# EAGLE design Hotec_H-bridge (EAGLE 7.6.0)
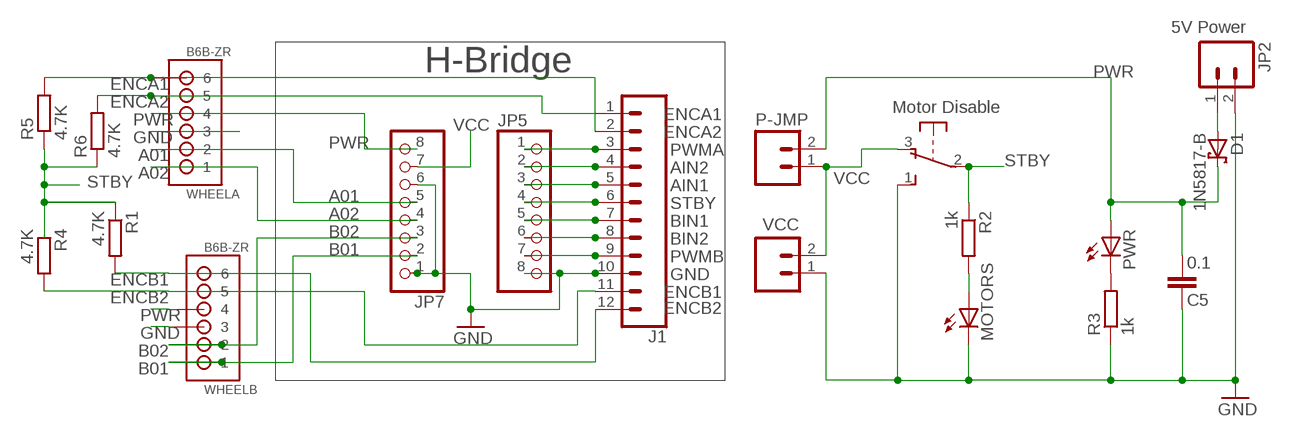
[diagram p0: schematic, sheet 1]

## Parts
C5  0.1  CAPEZ  [CAP-PTH-SMALLEZ]
D1  1N5817-B  [DO41-7.6]
J1  CONN_12  [1X12]
JP2  M023.5MM  [SCREWTERMINAL-3.5MM-2]
JP5  PINHD-1X8CLEANBIG  [1X08-CLEANBIG]
JP7  PINHD-1X8CLEANBIG  [1X08-CLEANBIG]
MOTORS  LED3MM  [LED3MM]
P-JMP  M02PTH  [1X02]
PWR  LED3MM  [LED3MM]
R1  4.7K  R-EU_0204/7  [0204/7]
R2  1k  R-EU_0204/7  [0204/7]
R3  1k  R-EU_0204/7  [0204/7]
R4  4.7K  R-EU_0204/7  [0204/7]
R5  4.7K  R-EU_0204/7  [0204/7]
R6  4.7K  R-EU_0204/7  [0204/7]
SW1  OS102011MA1Q  [OS102011MA1Q]
VCC  M02PTH  [1X02]
WHEELA  B6B-ZR  [B6B-ZR]
WHEELB  B6B-ZR  [B6B-ZR]

## Nets
A01: JP7.5 WHEELA.2
A02: JP7.4 WHEELA.1
AIN1: J1.5 JP5.3
AIN2: J1.4 JP5.2
B01: JP7.2 WHEELB.1
B02: JP7.3 WHEELB.2
BIN1: J1.7 JP5.5
BIN2: J1.8 JP5.6
ENCA1: J1.2 R5.2 WHEELA.6
ENCA2: J1.1 R6.2 WHEELA.5
ENCB1: J1.12 R1.2 WHEELB.6
ENCB2: J1.11 R4.2 WHEELB.5
GND: C5.1 J1.10 JP2.2 JP5.8 JP7.1 JP7.6 MOTORS.K(C) R3.1 SW1.1(S) VCC.1 WHEELA.3 WHEELB.3
N$3: PWR.K(C) R3.2
N$8: MOTORS.A R2.2
N$17: D1.A JP2.1
PWMA: J1.3 JP5.1
PWMB: J1.9 JP5.7
PWR: C5.2 D1.C JP7.8 P-JMP.2 PWR.A WHEELA.4 WHEELB.4
STBY: J1.6 JP5.4 R1.1 R2.1 R4.1 R5.1 R6.1 SW1.2(P)
VCC: JP7.7 P-JMP.1 SW1.3(O) VCC.2
Unconnected: SW1.MT1(MT) SW1.MT2(MT)

## Notes on the sheet
- 5V Power
- H-Bridge
- Motor Disable

## Library data of the parts
C5 = SparkFun-Passives:CAP: Capacitor Standard 0603 ceramic capacitor, and 0.1" leaded capacitor.
D1 = diode:1N581*: 1.0A SCHOTTKY BARRIER RECTIFIER Source: http://www.diodes.com/datasheets/ds23001.pdf
J1 = SparkFun-Connectors:CONN_12: Multi connection point. Often used as Generic Header-pin footprint for 0.1 inch spaced/style header connections On any of the 0.1 inch spaced packages, you can populate with these: Break Away Headers - Straight <https://www.sparkfun.com/products/116> (PRT-00116) Break Away Male Headers - Right Angle <https://www.sparkfun.com/products/553> (PRT-00553) Female Headers <https://www.sparkfun.com/products/115> (PRT-00115) Break Away Headers - Machine Pin <https://www.sparkfun.com/products/117> (PRT-00117) Break Away Female Headers - Swiss Machine Pin <https://www.sparkfun.com/products/743> (PRT-00743) For SCREWTERMINALS and SPRING TERMINALS visit here: Screw Terimnals on SparkFun.com <https://www.sparkfun.com/search/results?term=Screw+Terminals> (5mm/3.5mm/2.54mm spacing) This device is also useful as a general connection point to wire up your design to another part of your project. Our various solder wires solder well into these plated through hole pads. Hook-Up Wire - Assortment (Stranded, 22 AWG) <https://www.sparkfun.com/products/11375> (PRT-11375) Hook-Up Wire - Assortment (Solid Core, 22 AWG) <https://www.sparkfun.com/products/11367> (PRT-11367) View the entire wire category on our website here <https://www.sparkfun.com/categories/141> Special notes: Molex polarized connector foot print use with SKU : PRT-08231 with associated crimp pins and housings. 1MM SMD Version SKU: PRT-10208 NOTES ON THE VARIANTS LOCK and LOCK_LONGPADS... This footprint was designed to help hold the alignment of a through-hole component (i.e. 6-pin header) while soldering it into place. You may notice that each hole has been shifted either up or down by 0.005 of an inch from it's more standard position (which is a perfectly straight line). This slight alteration caused the pins (the squares in the middle) to touch the edges of the holes. Because they are alternating, it causes a "brace" to hold the component in place. 0.005 has proven to be the perfect amount of "off-center" position when using our standard breakaway headers. Although looks a little odd when you look at the bare footprint, once you have a header in there, the alteration is very hard to notice. Also,if you push a header all the way into place, it is covered up entirely on the bottom side.
JP2 P-JMP VCC = SparkFun-Connectors:M02: Standard 2-pin 0.1" header. Use with - straight break away headers ( PRT-00116) - right angle break away headers (PRT-00553) - swiss pins (PRT-00743) - machine pins (PRT-00117) - female headers (PRT-00115) Molex polarized connector foot print use with: PRT-08233 with associated crimp pins and housings. 2.54_SCREWTERM for use with PRT-10571. 3.5mm Screw Terminal footprints for PRT-08084 5mm Screw Terminal footprints for use with PRT-08433
JP5 JP7 = adafruit:PINHD-1X8: PIN HEADER
MOTORS PWR = led:LED: LED OSRAM: - CHIPLED LG R971, LG N971, LY N971, LG Q971, LY Q971, LO R971, LY R971 LH N974, LH R974 LS Q976, LO Q976, LY Q976 LO Q996 - Hyper CHIPLED LW Q18S LB Q993, LB Q99A, LB R99A - SideLED LS A670, LO A670, LY A670, LG A670, LP A670 LB A673, LV A673, LT A673, LW A673 LH A674 LY A675 LS A676, LA A676, LO A676, LY A676, LW A676 LS A679, LY A679, LG A679 - Hyper Micro SIDELED® LS Y876, LA Y876, LO Y876, LY Y876 LT Y87S - SmartLED LW L88C, LW L88S LB L89C, LB L89S, LG L890 LS L89K, LO L89K, LY L89K LS L896, LA L896, LO L896, LY L896 - TOPLED LS T670, LO T670, LY T670, LG T670, LP T670 LSG T670, LSP T670, LSY T670, LOP T670, LYG T670 LG T671, LOG T671, LSG T671 LB T673, LV T673, LT T673, LW T673 LH T674 LS T676, LA T676, LO T676, LY T676, LB T676, LH T676, LSB T676, LW T676 LB T67C, LV T67C, LT T67C, LS T67K, LO T67K, LY T67K, LW E67C LS E67B, LA E67B, LO E67B, LY E67B, LB E67C, LV E67C, LT E67C LW T67C LS T679, LY T679, LG T679 LS T770, LO T770, LY T770, LG T770, LP T770 LB T773, LV T773, LT T773, LW T773 LH T774 LS E675, LA E675, LY E675, LS T675 LS T776, LA T776, LO T776, LY T776, LB T776 LHGB T686 LT T68C, LB T68C - Hyper Mini TOPLED® LB M676 - Mini TOPLED Santana® LG M470 LS M47K, LO M47K, LY M47K Source: http://www.osram.convergy.de LUXEON: - LUMILED® LXK2-PW12-R00, LXK2-PW12-S00, LXK2-PW14-U00, LXK2-PW14-V00 LXK2-PM12-R00, LXK2-PM12-S00, LXK2-PM14-U00 LXK2-PE12-Q00, LXK2-PE12-R00, LXK2-PE12-S00, LXK2-PE14-T00, LXK2-PE14-U00 LXK2-PB12-K00, LXK2-PB12-L00, LXK2-PB12-M00, LXK2-PB14-N00, LXK2-PB14-P00, LXK2-PB14-Q00 LXK2-PR12-L00, LXK2-PR12-M00, LXK2-PR14-Q00, LXK2-PR14-R00 LXK2-PD12-Q00, LXK2-PD12-R00, LXK2-PD12-S00 LXK2-PH12-R00, LXK2-PH12-S00 LXK2-PL12-P00, LXK2-PL12-Q00, LXK2-PL12-R00 Source: www.luxeon.com KINGBRIGHT: KA-3528ASYC Source: www.kingbright.com
R1-R6 = resistor:R-EU_: RESISTOR, European symbol
SW1 = adafruit_mem:OS102011MA1Q: OS10201MA1Q through-hole right angle switch http://www.ladyada.net/library/eagle
WHEELA WHEELB = jst:B6B-ZR: JST-ZH Connector 6 pol, 1.5mm pitch Package: B6B-ZR Source: http://www.jst-mfg.com/product/pdf/eng/eZH.pdf

## Net classes
1 power: width 0.305 mm, clearance 0.305 mm

## Board
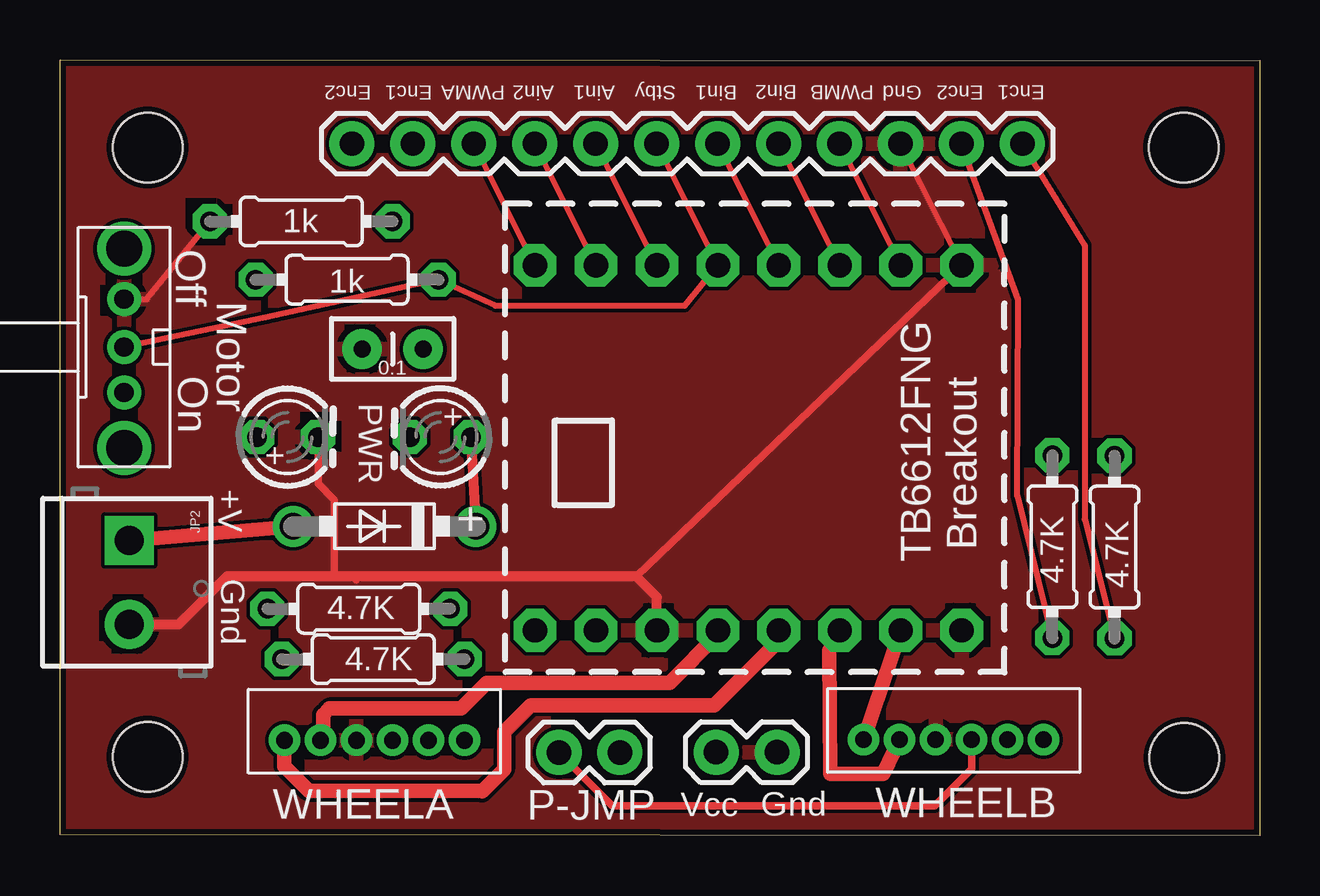
[diagram p1: board, top side]
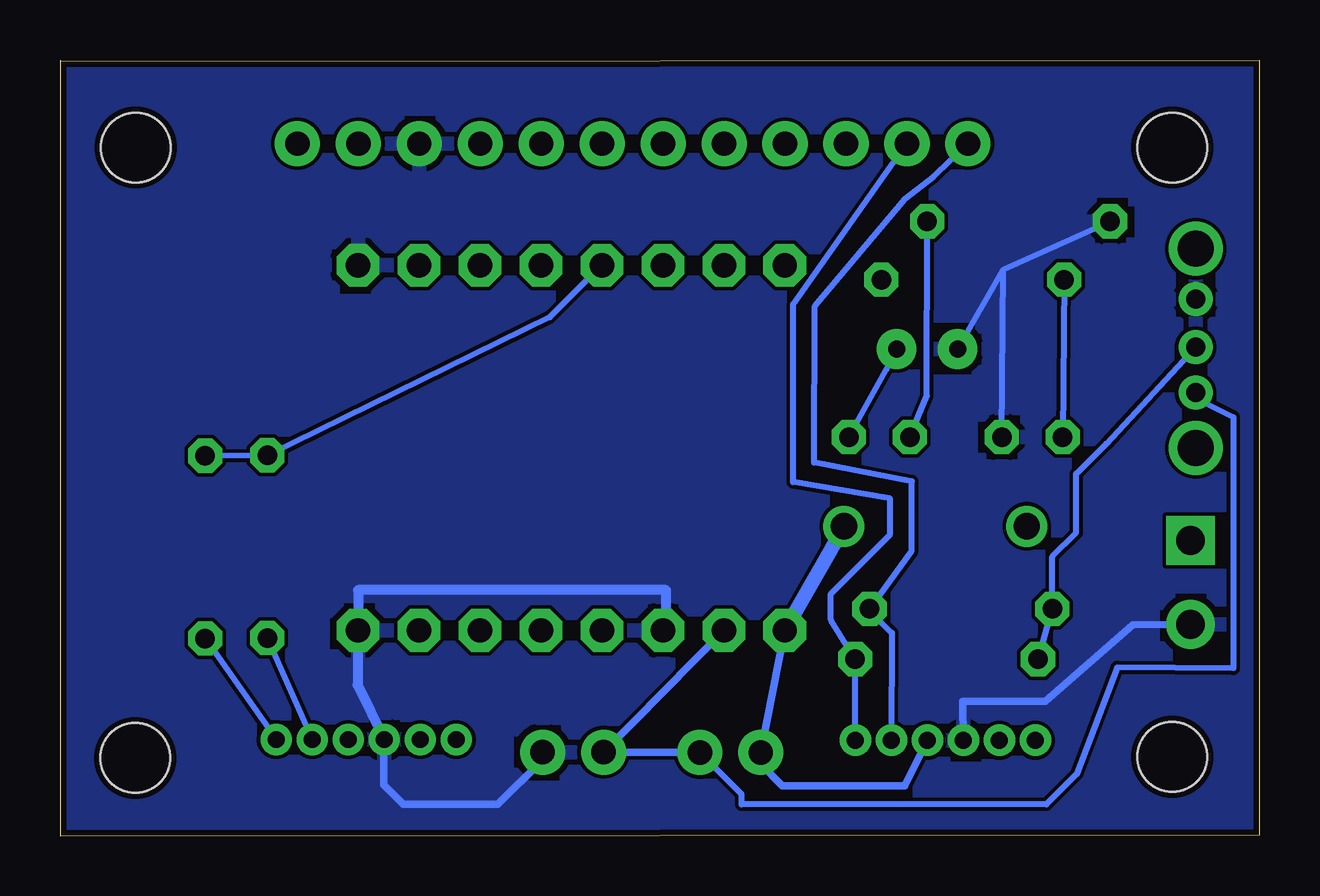
[diagram p2: board, bottom side, seen from below]

Size 49.99 x 32.35 mm. Coordinates in mm from the lower left corner, seen from the top.
Outline: 49.99,32.35 49.98,0 0,0.04 0,32.33 49.98,32.29
Copper layers (1*16): Top 0.035mm / dielectric 1.5mm / Bottom 0.035mm
Design rules "DFRobot_Eagle_Rule_v0.4": minimum track width 6mil, minimum drill 12mil, track to track 6mil, track to pad 6mil, pad to pad 6mil, via to via 6mil, smd to smd 0mil, copper to edge 10mil, drill to drill 10mil, minimum pad ring 12mil, minimum via ring 8mil, stop-mask expansion 2mil, vias tented up to drill 25mil, thermal gap 10mil
Holes 2.9 mm at 3.65,3.3 46.85,3.25 3.65,28.7 46.83,28.7
tRestrict: area 1.6,8.1 to 2.9,9.4; area 2.2,8.8 to 3.5,10.1; area 2.2,7.6 to 3.4,8.9; area 29.8,2.8 to 31,4.1; area 29.2,3.3 to 30.5,4.6; area 29.2,2.4 to 30.5,3.6; area 24.3,8.4 to 25.6,9.7; area 24.2,7.5 to 25.5,8.7; area 35.8,3.2 to 37,4.4; area 37.5,7.9 to 38.8,9.2; area 36.9,8.4 to 38.1,9.7; area 10.4,16 to 11.7,17.3; 11 more areas
bRestrict: area 1.9,21.7 to 3.5,23.1; area 36.9,8.4 to 38.1,9.7; area 37.5,7.8 to 38.7,9.1; area 23.2,7.9 to 24.5,9.1; area 24.2,8.4 to 25.5,9.7; area 24.2,7.5 to 25.4,8.8; area 29.8,2.9 to 31.1,4.1; area 29.2,2.3 to 30.4,3.6; area 35.8,3.5 to 37.1,4.8; area 29.1,3.4 to 30.4,4.6; area 11.6,3.1 to 12.9,4.4; area 2.2,7.5 to 3.5,8.8; 14 more areas

### Footprints (pad centres in the part's own frame; a part is rotated, then mirrored left to right if it is on the bottom)
CAP-PTH-SMALLEZ = drill 0.7 pad 1.651: 1 0,0; 2 2.54,0
DO41-7.6 = drill 1.1 pad 1.7: A 3.81,0; C -3.81,0
1X12 = drill 1.016 pad 1.88: 1 0,0; 2 2.54,0; 3 5.08,0; 4 7.62,0; 5 10.16,0; 6 12.7,0; 7 15.24,0; 8 17.78,0; 9 20.32,0; 10 22.86,0; 11 25.4,0; 12 27.94,0
SCREWTERMINAL-3.5MM-2 = drill 1.2 pad 2.032 square: 1 0,0 | drill 1.2 pad 2.032: 2 3.5,0
1X08-CLEANBIG = drill 1.016 pad 1.778 octagon: 1 -8.89,0; 2 -6.35,0; 3 -3.81,0; 4 -1.27,0; 5 1.27,0; 6 3.81,0; 7 6.35,0; 8 8.89,0
LED3MM = drill 0.813 octagon: A -1.27,0; K 1.27,0
1X02 = drill 1.016 pad 1.88: 1 0,0; 2 2.54,0
0204/7 = drill 0.813 octagon: 1 -3.81,0; 2 3.81,0
OS102011MA1Q = drill 0.8 pad 1.422: 1 -2,0; 2 0,0; 3 1.9,0 | drill 1.5 pad 2.184: MT1 -4.1,0; MT2 4.2,0
B6B-ZR = drill 0.7: 1 9,-1.3; 2 7.5,-1.3; 3 6,-1.3; 4 4.5,-1.3; 5 3,-1.3; 6 1.5,-1.3

### Placement (x,y rotation side)
C5  12.59,20.3 0 top
D1  13.52,12.91 180 top
J1  12.16,28.86 0 top
JP2  2.89,12.32 270 top
JP5  28.68,23.79 0 top
JP7  28.68,8.57 180 top
MOTORS  9.48,16.63 0 top
P-JMP  23.33,3.48 180 top
PWR  15.85,16.63 180 top
R1  43.94,12.04 270 top
R2  11.96,23.19 180 top
R3  10.05,25.62 0 top
R4  41.35,12.06 270 top
R5  13.05,7.37 0 top
R6  12.45,9.47 0 top
SW1  2.67,20.38 270 top
VCC  29.88,3.49 180 top
WHEELA  18.35,2.69 180 top
WHEELB  42.48,2.72 180 top

### Tracks (layer width: path | path; a pad name or v marks a point on that pad's centre or on a via)
A01
  Top 0.406: JP7.5 27.41,8.4 | 17.78,6.39 17.78,6.38 | 10.96,4.1 WHEELA.2
  Top 0.61: 27.41,8.4 25.4,6.39 17.78,6.39 | 17.78,6.38 16.71,5.31 11.22,5.31 10.96,5.05 10.96,4.1
A02
  Top 0.406: JP7.4 29.95,8.14 | 17.56,1.89 17.59,1.86
  Top 0.61: 29.95,8.14 27.25,5.44 19.61,5.44 18.5,4.33 18.5,2.77 17.59,1.86 | WHEELA.1 9.35,2.91 10.37,1.89 17.56,1.89
AIN1
  Top 0.254: 22.34,28.86 J1.5 JP5.3
AIN2
  Top 0.254: 19.8,28.86 J1.4 JP5.2
B01
  Top 0.61: JP7.2 WHEELB.1
B02
  Top 0.406: JP7.3 32.49,8.17 32.06,7.74
  Top 0.61: 32.06,7.74 32.1,2.59 34.31,2.59 WHEELB.2
BIN1
  Top 0.254: 27.42,28.86 J1.7 JP5.5
BIN2
  Top 0.254: 29.96,28.86 J1.8 JP5.6
ENCA1
  Bottom 0.254: WHEELA.6 R5.2 17.87,9.01 17.87,10.1 15.4,12.57 15.4,14.06 19.44,14.75 19.44,22.16 J1.2
ENCA2
  Bottom 0.254: WHEELA.5 15.33,8.47 16.26,9.4 R6.2 14.51,11.88 14.5,14.78 18.57,15.56 18.54,22.08 14.78,26.56 13.59,27.49 J1.1
ENCB1
  Top 0.254: R1.2 42.69,13.21 42.69,24.64 J1.12
  Bottom 0.254: R1.2 WHEELB.6
ENCB2
  Top 0.254: R4.2 39.88,14.19 39.92,22.37 J1.11
  Bottom 0.254: WHEELB.5 R4.2
GND
  Top 0.254: SW1.1 3.63,22.38 3.63,22.42 R3.1 | 35.04,28.86 J1.10 JP5.8
  Top 0.305: JP5.8 24.01,10.82 | MOTORS.K 10.75,14.69 11.43,14.01 11.43,10.83 | 12.35,10.67 12.19,10.83
  Top 0.406: 36.45,4.02 WHEELB.3 | JP7.6 24.87,9.96 24.01,10.82 24,10.83 12.19,10.83 11.43,10.83 6.96,10.83 4.95,8.82 JP2.2
  Bottom 0.254: MOTORS.K 10.68,23.61 | 10.68,23.61 R3.1 | C5.1 10.68,23.61
  Bottom 0.305: VCC.1 29.88,3.18 31.75,1.31 35.68,1.31 36.5,2.13 36.5,4 WHEELB.3 | WHEELA.3 12.37,5.61 8.93,5.61 5.29,8.8 JP2.2
  Bottom 0.406: JP7.6 24.74,8.57 24.74,10.25 37.57,10.25 JP7.1 37.59,8.57 37.59,6.28 WHEELB.3
  pour Top: 0,0.04 0,32.3 49.87,32.3 49.87,0.04
  pour Bottom: 0,0.04 0,32.34 49.81,32.34 49.81,0.04
  pour Bottom: 0,0.04 0,32.34 49.81,32.34 49.81,0.04
  pour Bottom: 0,0.04 0,32.34 49.81,32.34 49.81,0.04
N$3
  Bottom 0.254: PWR.K 13.87,18.34 13.86,25.48 R3.2
N$8
  Bottom 0.254: R2.2 MOTORS.A
N$17
  Top 0.61: JP2.1 D1.A
PWMA
  Top 0.254: 17.26,28.86 J1.3 JP5.1
PWMB
  Top 0.254: 32.5,28.86 J1.9 JP5.7
PWR
  Top 0.305: WHEELB.4 37.98,2.8 36.44,1.26 23.01,1.26 P-JMP.2
  Top 0.406: PWR.A D1.C
  Bottom 0.254: PWR.A 15.56,19.45 C5.2
  Bottom 0.305: JP7.8 P-JMP.2 20.79,3 19.89,2.1 14.79,2.1 WHEELA.4
  Bottom 0.61: JP7.8 17.91,11.83 D1.C
STBY
  Top 0.254: SW1.2 8.56,21.62 R2.1 18.15,22.11 26.03,22.11 JP5.4 J1.6 24.88,28.86
  Bottom 0.254: JP5.4 29.58,21.63 R4.1 R1.1 | R5.1 R6.1 8.64,11.65 7.65,12.64 7.65,15.1 6.4,16.35 SW1.2
VCC
  Bottom 0.254: SW1.3 3.15,18.48 1.1,17.46 1.1,6.99 5.94,7.02 7.62,2.58 8.89,1.31 21.59,1.31 21.59,1.74 P-JMP.1
  Bottom 0.305: JP7.7 VCC.2 P-JMP.1

### Text on the board
tPlace: TB6612FNG / Breakout
tNames: Enc2 | Enc1 | PWMA | Ain2 | Ain1 | Stby | Bin1 | Bin2 | PWMB | Gnd | Enc2 | Enc1 | Off | Motor | On | + | + | +V | + | Gnd | Vcc | Gnd
Document: Mod for new pinout: / cut trace to pin 4 and connect to pin 2 / cut trace from servo and connect to pin 4 (note wrong labels for servo pins) / connect trace to 20 (A6) - note pin 6 and 20 swapped in code